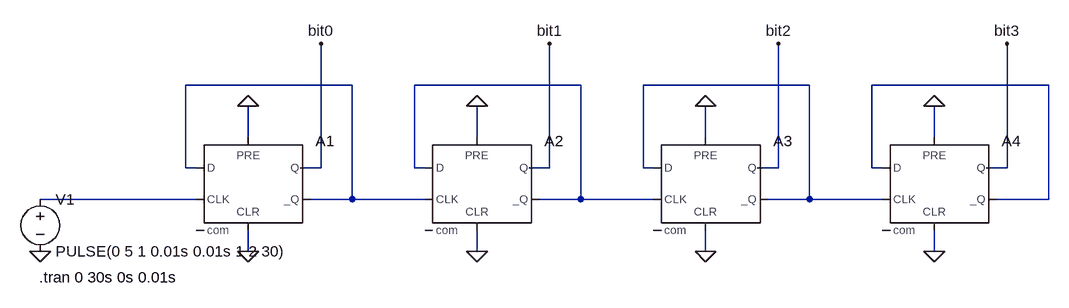
[diagram p0: schematic counter.asc]
counter.asc, the LTspice schematic file:
Version 4
SHEET 1 1780 680
WIRE 704 16 448 16
WIRE 1056 16 800 16
WIRE 1408 16 1152 16
WIRE 1776 16 1504 16
WIRE 544 96 544 48
WIRE 896 96 896 48
WIRE 1248 96 1248 48
WIRE 1600 96 1600 48
WIRE 448 144 448 16
WIRE 464 144 448 144
WIRE 656 144 656 -48
WIRE 656 144 624 144
WIRE 800 144 800 16
WIRE 816 144 800 144
WIRE 1008 144 1008 -48
WIRE 1008 144 976 144
WIRE 1152 144 1152 16
WIRE 1168 144 1152 144
WIRE 1360 144 1360 -48
WIRE 1360 144 1328 144
WIRE 1504 144 1504 16
WIRE 1520 144 1504 144
WIRE 1712 144 1712 -48
WIRE 1712 144 1680 144
WIRE 464 192 224 192
WIRE 704 192 704 16
WIRE 704 192 640 192
WIRE 816 192 704 192
WIRE 1056 192 1056 16
WIRE 1056 192 992 192
WIRE 1168 192 1056 192
WIRE 1408 192 1408 16
WIRE 1408 192 1344 192
WIRE 1520 192 1408 192
WIRE 1776 192 1776 16
WIRE 1776 192 1696 192
WIRE 544 272 544 240
WIRE 896 272 896 240
WIRE 1248 272 1248 240
WIRE 1600 272 1600 240
FLAG 224 272 0
FLAG 656 -48 bit0
FLAG 1008 -48 bit1
FLAG 1360 -48 bit2
FLAG 1712 -48 bit3
FLAG 544 272 0
FLAG 896 272 0
FLAG 1248 272 0
FLAG 1600 272 0
FLAG 544 48 0
FLAG 896 48 0
FLAG 1248 48 0
FLAG 1600 48 0
SYMBOL voltage 224 176 R0
WINDOW 123 0 0 Left 0
WINDOW 39 0 0 Left 0
SYMATTR InstName V1
SYMATTR Value PULSE(0 5 1 0.01s 0.01s 1 2 30)
SYMBOL Digital\\dflop 544 96 R0
SYMATTR InstName A1
SYMBOL Digital\\dflop 896 96 R0
SYMATTR InstName A2
SYMBOL Digital\\dflop 1248 96 R0
SYMATTR InstName A3
SYMBOL Digital\\dflop 1600 96 R0
SYMATTR InstName A4
TEXT 222 312 Left 2 !.tran 0 30s 0s 0.01s

The netlist it stands for:
* counter.asc
V1 N005 0 PULSE(0 5 1 0.01s 0.01s 1 2 30)
A1 N001 0 N005 0 0 N001 bit0 0 DFLOP
A2 N002 0 N001 0 0 N002 bit1 0 DFLOP
A3 N003 0 N002 0 0 N003 bit2 0 DFLOP
A4 N004 0 N003 0 0 N004 bit3 0 DFLOP
.tran 0 30s 0s 0.01s
.backanno
.end